# EAGLE design sensor (EAGLE 9.0.1)
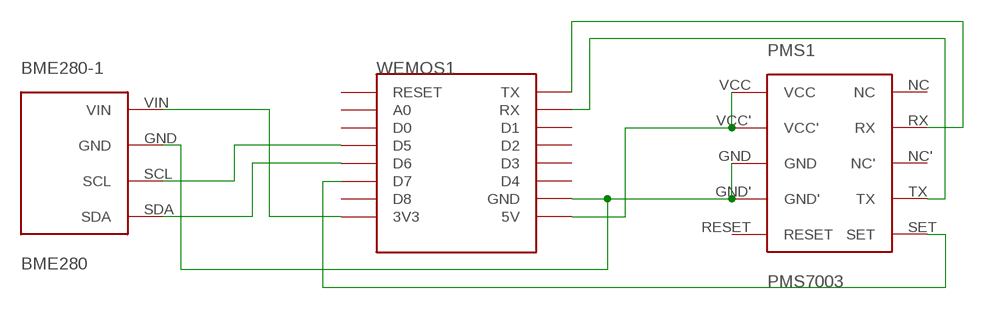
[diagram p0: schematic, sheet 1]

## Parts
BME280-1  BME280  [BME280]
PMS1  PMS7003  [PMS7003]
WEMOS1  WEMOS-D1-MINI  [WEMOS-D1-MINI]

## Nets
GND: BME280-1.GND PMS1.GND PMS1.GND' WEMOS1.GND
N$1: BME280-1.SCL WEMOS1.D5
N$2: BME280-1.SDA WEMOS1.D6
N$3: BME280-1.VIN WEMOS1.3V3
N$5: PMS1.SET WEMOS1.D7
N$6: PMS1.VCC PMS1.VCC' WEMOS1.5V
N$7: PMS1.RX WEMOS1.TX
N$8: PMS1.TX WEMOS1.RX
Unconnected: PMS1.NC PMS1.NC' PMS1.RESET WEMOS1.A0 WEMOS1.D0 WEMOS1.D1 WEMOS1.D2 WEMOS1.D3 WEMOS1.D4 WEMOS1.D8 WEMOS1.RESET

## Library data of the parts
BME280-1 = BME280:BME280
PMS1 = pms7003:PMS7003
WEMOS1 = esp8266modules:WEMOS-D1-MINI: WeMos.cc D1 mini ESP8266 module

## Board
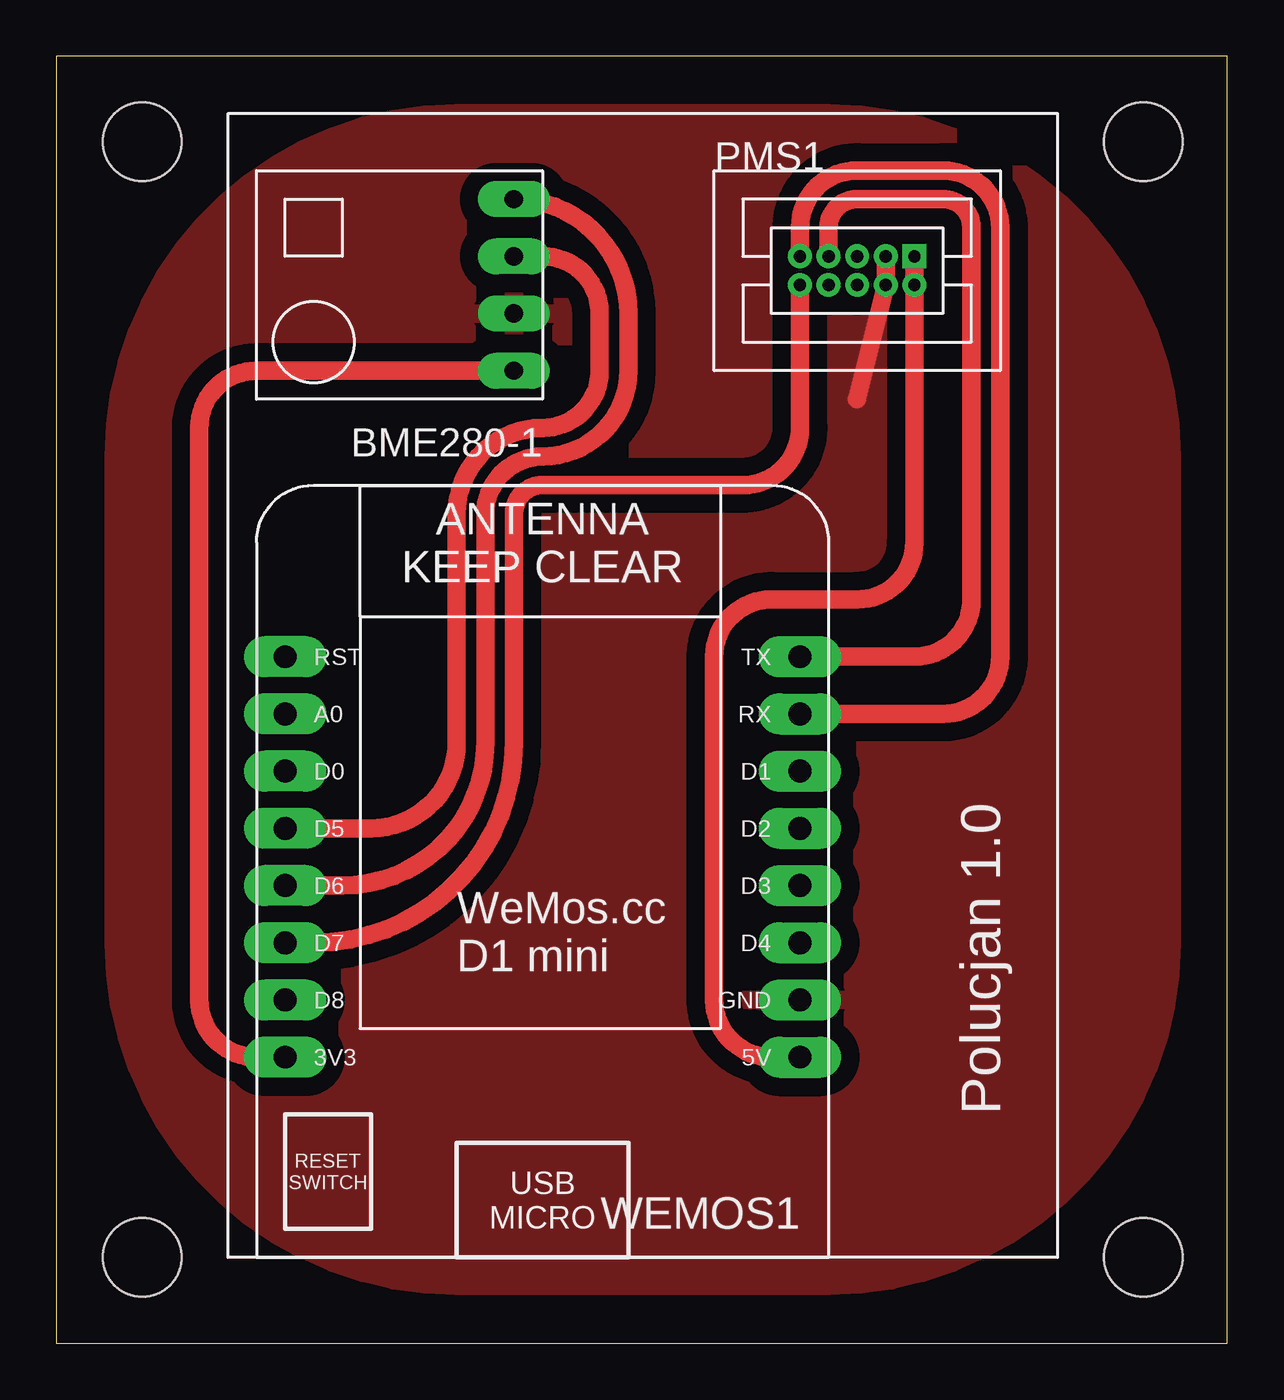
[diagram p1: board, top side]

Size 51.99 x 57.14 mm. Coordinates in mm from the lower left corner, seen from the top.
Outline: 0,0 51.99,0 51.99,57.14 0,57.14 0,0
Copper layers (1*16): Top 0.035mm / dielectric 1.5mm / Bottom 0.035mm
Design rules "default": minimum track width 6mil, minimum drill 0.35mm, track to track 6mil, track to pad 6mil, pad to pad 6mil, via to via 6mil, smd to smd 6mil, copper to edge 40mil, drill to drill 6mil, minimum pad ring 10mil, minimum via ring 8mil, stop-mask expansion 4mil, vias tented up to drill 0mil, thermal gap 10mil
Holes 3.5 mm at 3.81,3.81 48.26,3.81 3.81,53.34 48.26,53.34

### Footprints (pad centres in the part's own frame; a part is rotated, then mirrored left to right if it is on the bottom)
BME280 = drill 0.813 pad 1.6 long: GND 0,1.27; SCL 0,-1.27; SDA 0,-3.81; VIN 0,3.81
PMS7003 = drill 0.55: GND -7.62,-6.35; GND' -7.62,-7.62; NC -8.89,-7.62; NC' -10.16,-7.62; RESET -8.89,-6.35; RX -10.16,-6.35; SET -11.43,-7.62; TX -11.43,-6.35; VCC' -6.35,-7.62 | drill 0.55 square: VCC -6.35,-6.35
WEMOS-D1-MINI = drill 1.016 pad 1.829 long: 3V3 -10.16,-10.16; 5V 12.7,-10.16; A0 -10.16,5.08; D0 -10.16,2.54; D1 12.7,2.54; D2 12.7,0; D3 12.7,-2.54; D4 12.7,-5.08; D5 -10.16,0; D6 -10.16,-2.54; D7 -10.16,-5.08; D8 -10.16,-7.62; GND 12.7,-7.62; RESET -10.16,7.62; RX 12.7,5.08; TX 12.7,7.62

### Placement (x,y rotation side)
BME280-1  20.32,46.99 180 top
PMS1  44.45,54.61 0 top
WEMOS1  20.32,22.86 0 top

### Tracks (layer width: path | path; a pad name or v marks a point on that pad's centre or on a via)
GND
  Top 0.813: PMS1.GND PMS1.GND' 35.56,41.91
  pour Top (isolate 0.813): 25.4,2.54 17.78,2.54 arc-90 2.54,17.78 2.54,39.37 arc-90 17.78,54.61 34.29,54.61 arc-90 49.53,39.37 49.53,17.78 arc-90 34.29,2.54
N$1
  Top 0.813: BME280-1.SCL 21.59,48.26 arc-90 24.13,45.72 24.13,43.18 arc-90 21.59,40.64 arc90 17.78,36.83 17.78,26.67 arc-90 13.97,22.86 WEMOS1.D5
N$2
  Top 0.813: WEMOS1.D6 12.7,20.32 arc90 19.05,26.67 19.05,36.83 arc-90 21.59,39.37 arc90 25.4,43.18 25.4,45.72 arc90 BME280-1.SDA
N$3
  Top 0.813: WEMOS1.3V3 8.89,12.7 arc-90 6.35,15.24 6.35,40.64 arc-90 8.89,43.18 BME280-1.VIN
N$5
  Top 0.813: WEMOS1.D7 11.43,17.78 arc90 20.32,26.67 20.32,36.83 arc-90 21.59,38.1 30.48,38.1 arc90 33.02,40.64 PMS1.SET
N$6
  Top 0.813: WEMOS1.5V 31.75,12.7 arc-90 29.21,15.24 29.21,30.48 arc-90 31.75,33.02 35.56,33.02 arc90 38.1,35.56 PMS1.VCC' PMS1.VCC
N$7
  Top 0.813: WEMOS1.TX 38.1,30.48 arc90 40.64,33.02 40.64,49.53 arc90 39.37,50.8 35.56,50.8 arc90 34.29,49.53 PMS1.RX
N$8
  Top 0.813: PMS1.TX 33.02,49.53 arc-90 35.56,52.07 39.37,52.07 arc-90 41.91,49.53 41.91,30.48 arc-90 39.37,27.94 WEMOS1.RX

### Text on the board
tNames: Polucjan 1.0